# Altium schematic sheet New Power (Becca).SchDoc
size A
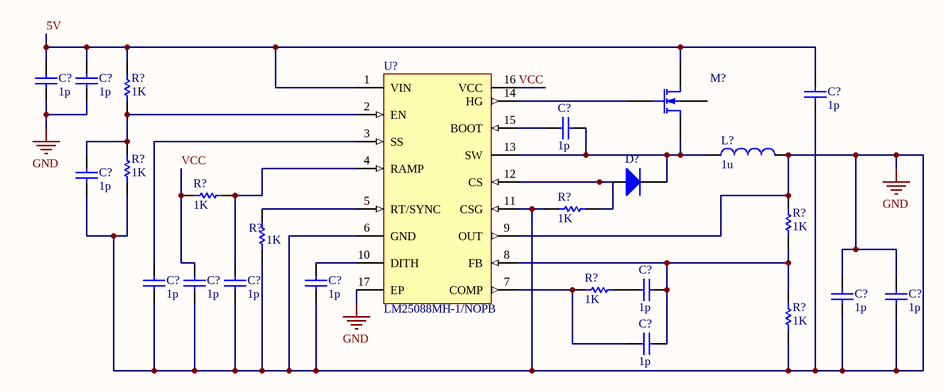
[diagram p0: New Power (Becca).SchDoc]

## Parts
(Parts that share a designator on the sheet are numbered #1, #2 ... from top to bottom, then left to right.)
C?#1  value 1p  (hidden comment: Capacitor)
C?#2  value 1p  (hidden comment: Capacitor)
C?#3  value 1p  (hidden comment: Capacitor)
C?#4  value 1p  (hidden comment: Capacitor)
C?#5  value 1p  (hidden comment: Capacitor)
C?#6  value 1p  (hidden comment: Capacitor)
C?#7  value 1p  (hidden comment: Capacitor)
C?#8  value 1p  (hidden comment: Capacitor)
C?#9  value 1p  (hidden comment: Capacitor)
C?#10  value 1p  (hidden comment: Capacitor)
C?#11  value 1p  (hidden comment: Capacitor)
C?#12  value 1p  (hidden comment: Capacitor)
C?#13  value 1p  (hidden comment: Capacitor)
D?  Diode  (value not drawn)
L?  value 1u  (hidden comment: Inductor)
M?  N-channel MOS1 MOSFET Shichman and Hodges Model  (value not drawn)
R?#1  value 1K  (hidden comment: Resistor)
R?#2  value 1K  (hidden comment: Resistor)
R?#3  value 1K  (hidden comment: Resistor)
R?#4  value 1K  (hidden comment: Resistor)
R?#5  value 1K  (hidden comment: Resistor)
R?#6  value 1K  (hidden comment: Resistor)
R?#7  value 1K  (hidden comment: Resistor)
R?#8  value 1K  (hidden comment: Resistor)
U?  LM25088MH-1/NOPB  [PWP0016A_N]

## Nets
GND: C?#1.1 C?#2.1 C?#3.1 C?#5.1 C?#7.1 C?#8.1 C?#9.1 C?#10.1 C?#11.1 C?#11.2 C?#12.1 C?#12.2 L?.2 R?#2.1 R?#4.1 R?#5.2 R?#6.1 R?#8.1 U?.6(GND) U?.9(OUT) U?.11(CSG) U?.17(EP)
5V: C?#1.2 C?#2.2 C?#3.2 M?.1(D) R?#1.2 U?.1(VIN)
VCC: C?#8.2 R?#3.1 U?.16(VCC)
NetC?#4_1: C?#4.1 U?.15(BOOT)
NetC?#4_2: C?#4.2 D?.2(K) L?.1 M?.3(S) U?.13(SW)
NetC?#5_2: C?#5.2 R?#1.1 R?#2.2 U?.2(EN)
NetC?#6_1: C?#6.1 R?#7.2
NetC?#6_2: C?#6.2 C?#13.2 R?#5.1 R?#8.2 U?.8(FB)
NetC?#7_2: C?#7.2 U?.3(SS)
NetC?#9_2: C?#9.2 R?#3.2 U?.4(RAMP)
NetC?#10_2: C?#10.2 U?.10(DITH)
NetC?#13_1: C?#13.1 R?#7.1 U?.7(COMP)
NetD?_1: D?.1(A) R?#4.2 U?.12(CS)
NetM?_2: M?.2(G) U?.14(HG)
NetR?#6_2: R?#6.2 U?.5(RT/SYNC)

Not connected (* = marked no-connect by the designer): M? 4(B)

## Library data of the parts
C?#1-C?#13 = Capacitor: SimulationGenericComponent: True
D? = Diode: AF: 1; BV: 0; BV_MAX: 1e99; EG: 1.11; FC: 0.5; IBV: 0.001; ISR: 1e-14; MJSW: 0.33; NTUN: 30; TNOM: 27; XTI: 3; SimulationGenericComponent: True; CJO: 0; CJP: 0; CTA: 0; CTP: 0; FCS: 0.5; FV_MAX: 1e99; IKF: 0; IKR: 0; JSW: 0; JTUN: 0; JTUNSW: 0; KEG: 1; KF: 0; LEVEL: 1; N: 1; NBV: 1; NR: 1; NS: 1; PHP: 1; RS: 0; TCV: 0; TLEV: 0; TLEVC: 0; TM1: 0; TM2: 0; TPB: 0; TPHP: 0; TRS: 0; TRS2: 0; TT: 0; TTT1: 0; TTT2: 0; VJ: 1; XTITUN: 3; IS: 1e-14
L? = Inductor: SimulationGenericComponent: True
M? = MOSFET N-ch Lev1: CBD: 0; FC: 0.5; IS: 1e-14; KP: 2e-05; PB: 0.8; PHI: 0.6; TNOM: 27; SimulationGenericComponent: True; CBS: 0; CGBO: 0; CGDO: 0; CGSO: 0; CJ: 0; CJSW: 0; GAMMA: 0; JS: 0; LAMBDA: 0; LD: 0; MJ: 0.5; MJSW: 0.5; NSS: 0; NSUB: 0; RD: 0; RS: 0; RSH: 0; TOX: 0; TPG: 0; U0: 0; VTO: 0
R?#1-R?#8 = Resistor: TC1: 0; SimulationGenericComponent: True; TC2: 0
U? = CMP-0063-01290-3: Wide Input Range Non-Synchronous Buck Controller, 16-pin TSSOP-EP, Pb-Free; Manufacturer: Texas Instruments; PowerWise: Y; CompType: MiscPower; PackageTopMarking: NSUZXYTT*L25088*MH-1; Code_JEDEC: MO-153-ABT; PinCount: 16; ComponentLink1Description: Datasheet URL; RoHS: Y; PackageDescription: Molded TSSOP, Jedec, Exposed Pad, 5.0 x 4.4 x 0.9mm Body,16 Lead, 0.65mm Pitch; PackageReference: PWP0016A; ComponentLink1URL: http://www.ti.com/general/docs/lit/getliterature.tsp?genericPartNumber=LM25088&fileType=pdf